# Altium project TundraHaptics.PrjPcb
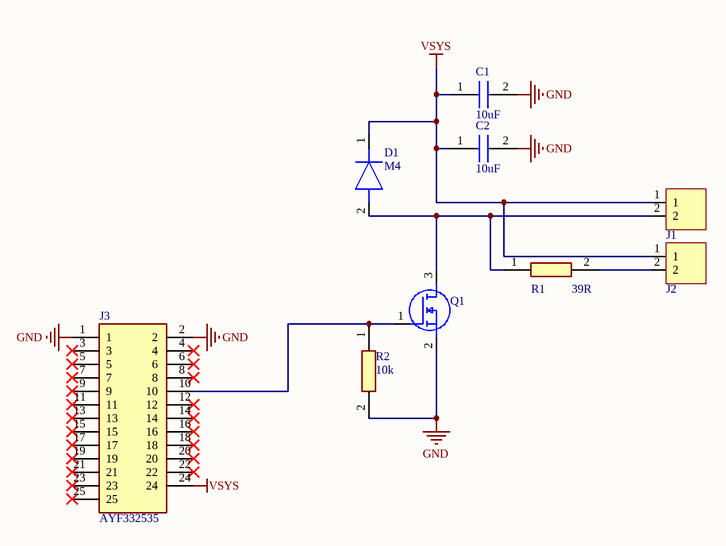
[diagram p0: TundraHaptics.SchDoc]
1 sheet, 9 parts. Net scope: global (net labels, ports and power ports of the same name join across sheets).
Board file: TundraHaptics.PcbDoc

## Sheet TundraHaptics.SchDoc
size A; SheetNumber: 1; SheetTotal: 1

### Parts
C1  10uF  [CAPC2012X140N]
C2  10uF  [CAPC2012X140N]
D1  M4  [DIOM5327X240N]
J1  Haptic Pads  [Haptic Pads]  (value not drawn)
J2  Haptic Pads  [Haptic Pads]  (value not drawn)
J3  AYF332535  [AYF332535]
Q1  N Channel Mosfet  [SOT95P237X112-3N]  (value not drawn)
R1  39R  [RESC3116X65N]
R2  10k  [RESC1608X55N]

### Nets
GND: C1.2 C2.2 J3.1 J3.2 Q1.2(S) R2.2
VSYS: C1.1 C2.1 D1.1(K) J1.1 J2.1 J3.24
NetD1_2: D1.2(A) J1.2 Q1.3(D) R1.1
NetJ2_2: J2.2 R1.2
NetJ3_10: J3.10 Q1.1(G) R2.1

Not connected (* = marked no-connect by the designer): J3 3* 4* 5* 6* 7* 8* 9* 11* 12* 13* 14* 15* 16* 17* 18* 19* 20* 21* 22* 23* 25*

### Library data of the parts
C1 C2 = C0805C106K8PACTU-2.5: Capacitor; Manufacturer_Name: KEMET; Datasheet Link: https://www.kemet.com/specsheet/C0805C106K8PACTU; Height: 1.4mm; Manufacturer_Part_Number: C0805C106K8PACTU-2.5; Mouser Part Number: N/A; Mouser Price/Stock: https://www.mouser.com/Search/Refine.aspx?Keyword=N%2FA
D1 = M4: Diode; Manufacturer_Name: Diotec; Datasheet Link: https://diotec.com/request/datasheet/m1.pdf; Height: 2.4mm; Manufacturer_Part_Number: M4; Mouser Part Number: 637-M4; Mouser Price/Stock: https://www.mouser.co.uk/ProductDetail/Diotec-Semiconductor/M4?qs=OlC7AqGiEDkbHMrD%252B6G9HQ%3D%3D
J3 = AYF332535: Connector; Manufacturer_Name: Panasonic; Datasheet Link: https://www3.panasonic.biz/ac/cdn/e/control/connector/fpc-ffc/catalog/con_eng_y3b.pdf; Height: 1mm; Manufacturer_Part_Number: AYF332535; Mouser Part Number: 769-AYF332535; Mouser Price/Stock: https://www.mouser.co.uk/ProductDetail/Panasonic-Industrial-Devices/AYF332535?qs=RtJ0qN3Pzof%252BwnUyi8U%252B%2FA%3D%3D; Arrow Part Number: AYF332535; Arrow Price/Stock: https://www.arrow.com/en/products/ayf332535/panasonic?region=nac
Q1 = SI2302CDS-T1-E3: Mosfet; Supplier 1: Mouser; Supplier Part Number 1: 781-SI2302CDS-E3
R1 = RC1206FR-0751RL: 39R Resistor; Manufacturer_Name: KEMET; Manufacturer_Part_Number: RC1206FR-0739RL; Datasheet Link: https://www.sos.sk/productdata/35/10/4/35104/RC1206.pdf; Height: 0.65mm; Mouser Part Number: 603-RC1206FR-0739RL; Mouser Price/Stock: https://www.mouser.com/Search/Refine.aspx?Keyword=603-RC1206FR-0751RL
R2 = RC0603FR-0710KL: Resistor; Manufacturer_Name: KEMET; Datasheet Link: http://www.yageo.com/documents/recent/PYu-RC0603_51_RoHS_L_v5.pdf; Height: 0.55mm; Manufacturer_Part_Number: RC0603FR-0710KL; Mouser Part Number: 603-RC0603FR-0710KL; Mouser Price/Stock: https://www.mouser.co.uk/ProductDetail/YAGEO/RC0603FR-0710KL?qs=grNVn54RoB%252B3GtjbJj3wJQ%3D%3D; Arrow Part Number: RC0603FR-0710KL; Arrow Price/Stock: https://www.arrow.com/en/products/rc0603fr-0710kl/yageo?region=nac